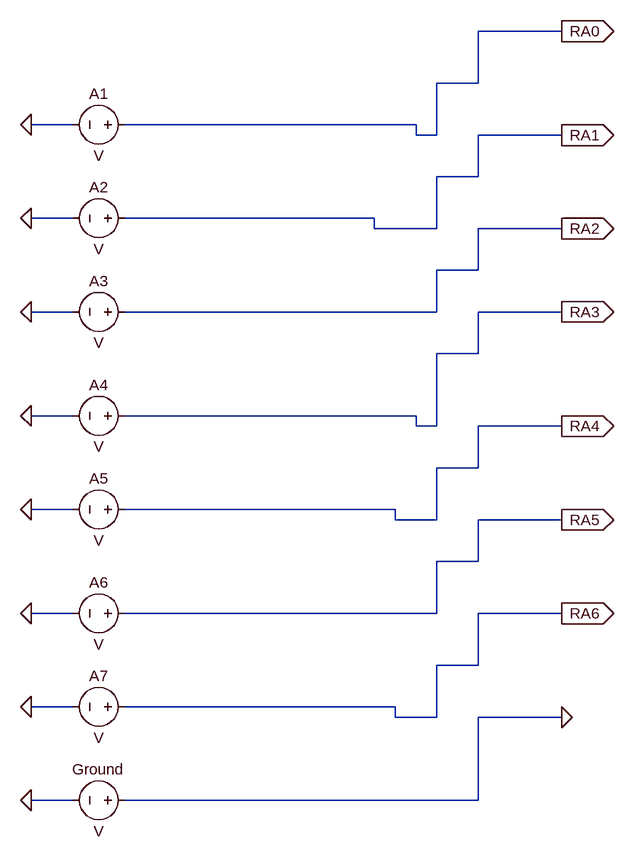
[diagram p0: schematic 8SR.asc]
8SR.asc, the LTspice schematic file:
Version 4.1
SHEET 1 984 1168
WIRE 784 -80 656 -80
WIRE 656 0 656 -80
WIRE 656 0 592 0
WIRE 32 64 -32 64
WIRE 560 64 112 64
WIRE 560 80 560 64
WIRE 592 80 592 0
WIRE 592 80 560 80
WIRE 784 80 656 80
WIRE 656 144 656 80
WIRE 656 144 592 144
WIRE 32 208 -32 208
WIRE 496 208 112 208
WIRE 496 224 496 208
WIRE 592 224 592 144
WIRE 592 224 496 224
WIRE 784 224 656 224
WIRE 656 288 656 224
WIRE 656 288 592 288
WIRE 32 352 -32 352
WIRE 592 352 592 288
WIRE 592 352 112 352
WIRE 784 352 656 352
WIRE 656 416 656 352
WIRE 656 416 592 416
WIRE 32 512 -32 512
WIRE 560 512 112 512
WIRE 560 528 560 512
WIRE 592 528 592 416
WIRE 592 528 560 528
WIRE 784 528 656 528
WIRE 656 592 656 528
WIRE 656 592 592 592
WIRE 32 656 -32 656
WIRE 528 656 112 656
WIRE 528 672 528 656
WIRE 592 672 592 592
WIRE 592 672 528 672
WIRE 784 672 656 672
WIRE 656 736 656 672
WIRE 656 736 592 736
WIRE 32 816 -32 816
WIRE 592 816 592 736
WIRE 592 816 112 816
WIRE 784 816 656 816
WIRE 656 896 656 816
WIRE 656 896 592 896
WIRE 32 960 -32 960
WIRE 528 960 112 960
WIRE 528 976 528 960
WIRE 592 976 592 896
WIRE 592 976 528 976
WIRE 784 976 656 976
WIRE 32 1104 -32 1104
WIRE 656 1104 656 976
WIRE 656 1104 112 1104
FLAG -32 1104 0
FLAG -32 64 0
FLAG -32 208 0
FLAG -32 352 0
FLAG -32 512 0
FLAG -32 656 0
FLAG -32 816 0
FLAG -32 960 0
FLAG 784 -80 RA0
IOPIN 784 -80 Out
FLAG 784 80 RA1
IOPIN 784 80 Out
FLAG 784 224 RA2
IOPIN 784 224 Out
FLAG 784 352 RA3
IOPIN 784 352 Out
FLAG 784 528 RA4
IOPIN 784 528 Out
FLAG 784 672 RA5
IOPIN 784 672 Out
FLAG 784 816 RA6
IOPIN 784 816 Out
FLAG 784 976 0
SYMBOL voltage 128 1104 R90
WINDOW 0 -32 56 VBottom 2
WINDOW 3 32 56 VTop 2
SYMATTR InstName Ground
SYMBOL voltage 128 64 R90
WINDOW 0 -32 56 VBottom 2
WINDOW 3 32 56 VTop 2
SYMATTR InstName A1
SYMBOL voltage 128 208 R90
WINDOW 0 -32 56 VBottom 2
WINDOW 3 32 56 VTop 2
SYMATTR InstName A2
SYMBOL voltage 128 352 R90
WINDOW 0 -32 56 VBottom 2
WINDOW 3 32 56 VTop 2
SYMATTR InstName A3
SYMBOL voltage 128 512 R90
WINDOW 0 -32 56 VBottom 2
WINDOW 3 32 56 VTop 2
SYMATTR InstName A4
SYMBOL voltage 128 656 R90
WINDOW 0 -32 56 VBottom 2
WINDOW 3 32 56 VTop 2
SYMATTR InstName A5
SYMBOL voltage 128 816 R90
WINDOW 0 -32 56 VBottom 2
WINDOW 3 32 56 VTop 2
SYMATTR InstName A6
SYMBOL voltage 128 960 R90
WINDOW 0 -32 56 VBottom 2
WINDOW 3 32 56 VTop 2
SYMATTR InstName A7

The netlist it stands for:
* 8SR.asc
V§Ground 0 0 V
V§A1 RA0 0 V
V§A2 RA1 0 V
V§A3 RA2 0 V
V§A4 RA3 0 V
V§A5 RA4 0 V
V§A6 RA5 0 V
V§A7 RA6 0 V
.backanno
.end